# Altium project Motor_Driver_2021.PrjPcb
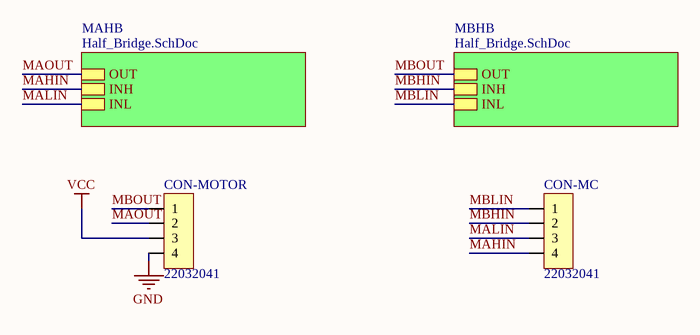
[diagram p0: Motor_Driver_2021.SchDoc]
2 sheets, 22 parts. Net scope: hierarchical (ports join the sheet entries above them; power ports are global).
Board file: Motor_Driver_2021.PcbDoc
Sheets:
  Motor_Driver_2021.SchDoc
    MBHB = Half_Bridge.SchDoc
    MAHB = Half_Bridge.SchDoc

## Sheet Motor_Driver_2021.SchDoc
size A4; SheetNumber: 1; SheetTotal: 2

### Parts
CON-MC  22032041  [04x01_Conector_Male]
CON-MOTOR  22032041  [04x01_Conector_Male]

### Sub-sheets
MAHB = Half_Bridge.SchDoc: OUT, INH, INL
MBHB = Half_Bridge.SchDoc: OUT, INH, INL

### Nets
GND: CON-MOTOR.4
VCC: CON-MOTOR.3
MAHIN: CON-MC.4 ; sheet MAHB/INH
MALIN: CON-MC.3 ; sheet MAHB/INL
MAOUT: CON-MOTOR.2 ; sheet MAHB/OUT
MBHIN: CON-MC.2 ; sheet MBHB/INH
MBLIN: CON-MC.1 ; sheet MBHB/INL
MBOUT: CON-MOTOR.1 ; sheet MBHB/OUT

### Library data of the parts
CON-MC CON-MOTOR = 04x01_Conector_Male-SCH: CONN HEADER 4POS .100 VERT TIN

## Sheet Half_Bridge.SchDoc
size A4; SheetNumber: 2; SheetTotal: 2
Used 2 times, as channels MBHB, MAHB. Parts and nets are listed once, with the designators drawn on the sheet.
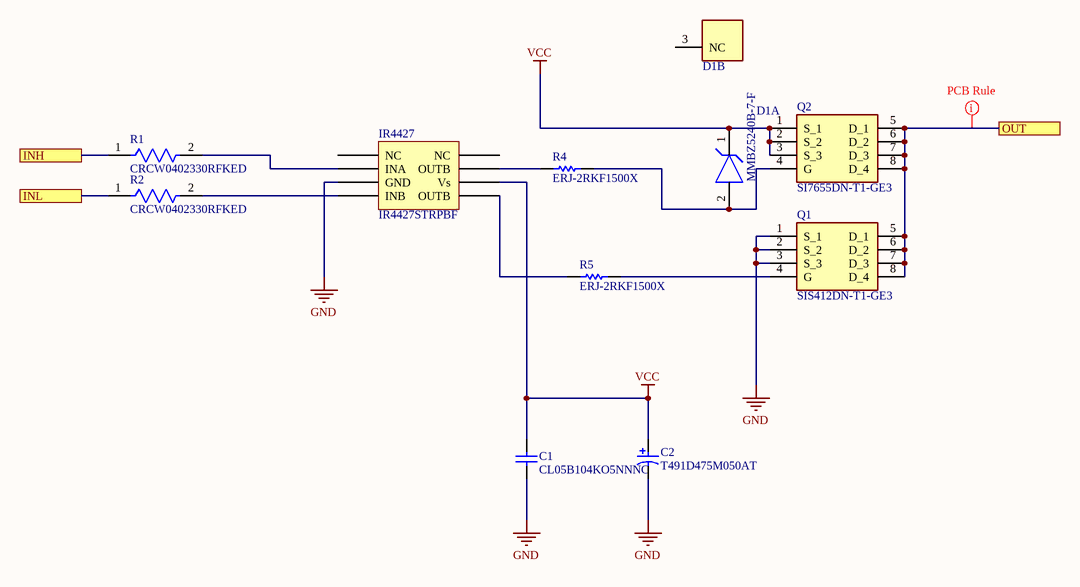
[diagram p1: Half_Bridge.SchDoc]

### Parts
C1  CL05B104KO5NNNC  [CAPC1050X55X23ML05T13]
C2  T491D475M050AT  [KEMT-T491-D_L]
D1  MMBZ5240B-7-F  [Diodes_SOT23_0]  (value not drawn)  (parts A,B of 2)
IR4427  IR4427STRPBF  [IR4427-PCB]
Q1  SIS412DN-T1-GE3  [POWERPAK-1212-8]
Q2  SI7655DN-T1-GE3  [POWERPAK-1212-8]
R1  CRCW0402330RFKED  [FP-CRCW0402-e3-MFG]
R2  CRCW0402330RFKED  [FP-CRCW0402-e3-MFG]
R4  ERJ-2RKF1500X  [RESC1005X40X25NL05T05]
R5  ERJ-2RKF1500X  [RESC1005X40X25NL05T05]

### Ports
INH, INL, OUT

### Nets
GND: C1.1 C2.2 IR4427.3(GND) Q1.1(S_1) Q1.2(S_2) Q1.3(S_3)
VCC: C1.2 C2.1 D1.1(C) IR4427.6(Vs) Q2.1(S_1) Q2.2(S_2) Q2.3(S_3)
INH: R1.1 ; port INH
INL: R2.1 ; port INL
OUT: Q1.5(D_1) Q1.6(D_2) Q1.7(D_3) Q1.8(D_4) Q2.5(D_1) Q2.6(D_2) Q2.7(D_3) Q2.8(D_4) ; port OUT
NetD1_2: D1.2(A) Q2.4(G) R4.2
NetIR4427_2: IR4427.2(INA) R1.2
NetIR4427_4: IR4427.4(INB) R2.2
NetIR4427_5: IR4427.5(OUTB) R5.1
NetIR4427_7: IR4427.7(OUTB) R4.1
NetQ1_4: Q1.4(G) R5.2

Not connected (* = marked no-connect by the designer): D1 3(NC); IR4427 1(NC) 8(NC)

### Channels
MBHB: designators end in _MBHB; ports INH=MBHIN INL=MBLIN OUT=MBOUT
MAHB: designators end in _MAHB; ports INH=MAHIN INL=MALIN OUT=MAOUT

### Layout directives
rule Polygon Connect Style [Style - Direct Connect]: MBOUT

### Library data of the parts
C1 = CMP-2000-05439-1: Chip Capacitor, 100 nF, +/- 10%, 16 V, -55 to 125 degC, 0402 (1005 Metric), RoHS, Tape and Reel; Manufacturer: Samsung Electro-Mechanics; Capacitance: 100000pF; Dielectric: X7R; Rated Voltage: 16V; Case Size/Dimension: 0402; Tolerance (%): ±10%; Manufacturer URL: http://www.samsungsem.com/global/index.jsp; Datasheet URL: https://datasheet.ciiva.com/29198/458718-da-01-en-vs-kondensator-0402-29198423.pdf; Datasheet Version: Nov-10
C2 = CMP-2000-07203-1: Tantalum Surface Mount Capacitor, 4.7 uF, +/- 20%, 50 V, -55 to 125 degC, 2-Pin SMD, RoHS, Tape and Reel; Manufacturer: Kemet; DF: 6%; Polarity: Polar; Voltage: 50VDC; Product Depth (mm): 4.3mm; Insulation: NotRequired; DCL: 2.4uA; Product Height (mm): 2.8mm; Rad Hardened: No; Capacitance: 4700000pF; Product Length (mm): 7.3mm; ESR: 1.4ohm; Case Style: Molded; Lead Spacing (nom): NotRequiredmm; Packaging: TapeandReel; Operating Temp Range: -55Cto125C; Mounting Style: SurfaceMount; Length W/Weld (max): NotRequiredmm; Package Reference: T491-D; Construction: SMTChip; Case Code: D; Package Description: 2-Pin Surface Mount Device, Body 7.3 x 4.3 mm; Seated Plane Height: NotRequiredmm; Wire Form: NotRequired; Mounting Technology: SurfaceMount; Manufacturer URL: http://www.kemet.com/; Seal: NotRequired; Tolerance (+ or -): 20%; Failure Rate: NotRequired; Datasheet Version: 06/2016; Length W/Weld: NotRequiredmm; Package / Case: 7343-31; Product Diameter (mm): NotRequiredmm; Datasheet URL: http://www.kemet.com/Lists/ProductCatalog/Attachments/254/KEM_T2005_T491.pdf
IR4427 = IR4427: IC DRIVER DUAL LOW SIDE 8-DIP
Q1 = SIS412DN-T1-GE3: MOSFET (N-Channel); Manufacturer_Name: Vishay; Datasheet Link: https://componentsearchengine.com//SIS412DN-T1-GE3.pdf; Mouser2 Part Number: 781-SIS412DN-T1-GE3; Mouser2 Price/Stock: https://www.mouser.com/Search/Refine.aspx?Keyword=781-SIS412DN-T1-GE3; Manufacturer_Part_Number: SIS412DN-T1-GE3
Q2 = SI7655DN-T1-GE3: MOSFET (P-Channel); Manufacturer_Name: Vishay; Datasheet Link: https://www.vishay.com/docs/63617/si7655dn.pdf; Manufacturer_Part_Number: SI7655DN-T1-GE3; Mouser Part Number: 78-SI7655DN-T1-GE3; Mouser Price/Stock: https://www.mouser.co.uk/ProductDetail/Vishay-Semiconductors/SI7655DN-T1-GE3?qs=8YL4b%2FT9KqrUzqvG%2FOmMqw%3D%3D; Arrow Part Number: SI7655DN-T1-GE3; Arrow Price/Stock: https://www.arrow.com/en/products/si7655dn-t1-ge3/vishay
R1 R2 = CMP-2002-08523-2: RES Thick Film, 330Ω, 1%, 0.063W, 100ppm/°C, 0402; Max Power Dissipation: 63mW; Voltage Rating (DC): 50V; Resistance: 330R; Case/Package: 0402; Packaging: Tape and Reel; Width: 0.5mm; Case Code (Metric): 1005; Radiation Hardening: No; Military Standard: Not; Contact Plating: Tin; Temperature Coefficient: 100ppm/°C; Lead Free: Lead Free; Power Rating: 63mW; Voltage Rating: 50V; Tolerance: 1%; Features: Automotive AEC-Q200; Case Code (Imperial): 0402; Composition: Thick Film; Weight: 2.3E-05oz; Package Quantity: 10; Min Operating Temperature: -55°C; Height: 0.35mm; Length: 1mm; Termination: SMD/SMT; Number of Terminations: 2; Depth: 0.5mm; Max Operating Temperature: 155°C
R4 R5 = CMP-1011-00415-2: Manufacturer: Panasonic; Part Number: ERJ-2RKF1500X

## Nets that join several sheets
GND: Motor_Driver_2021 (CON-MOTOR.4), MBHB (6 pins), MAHB (6 pins)
VCC: Motor_Driver_2021 (CON-MOTOR.3), MBHB (7 pins), MAHB (7 pins)
MAHIN: Motor_Driver_2021 (CON-MC.4), MAHB (R1_MAHB.1)
MALIN: Motor_Driver_2021 (CON-MC.3), MAHB (R2_MAHB.1)
MAOUT: Motor_Driver_2021 (CON-MOTOR.2), MAHB (8 pins)
MBHIN: Motor_Driver_2021 (CON-MC.2), MBHB (R1_MBHB.1)
MBLIN: Motor_Driver_2021 (CON-MC.1), MBHB (R2_MBHB.1)
MBOUT: Motor_Driver_2021 (CON-MOTOR.1), MBHB (8 pins)